# Altium schematic sheet mounting_circuit.SchDoc
size A4; SheetNumber: 2; SheetTotal: 5
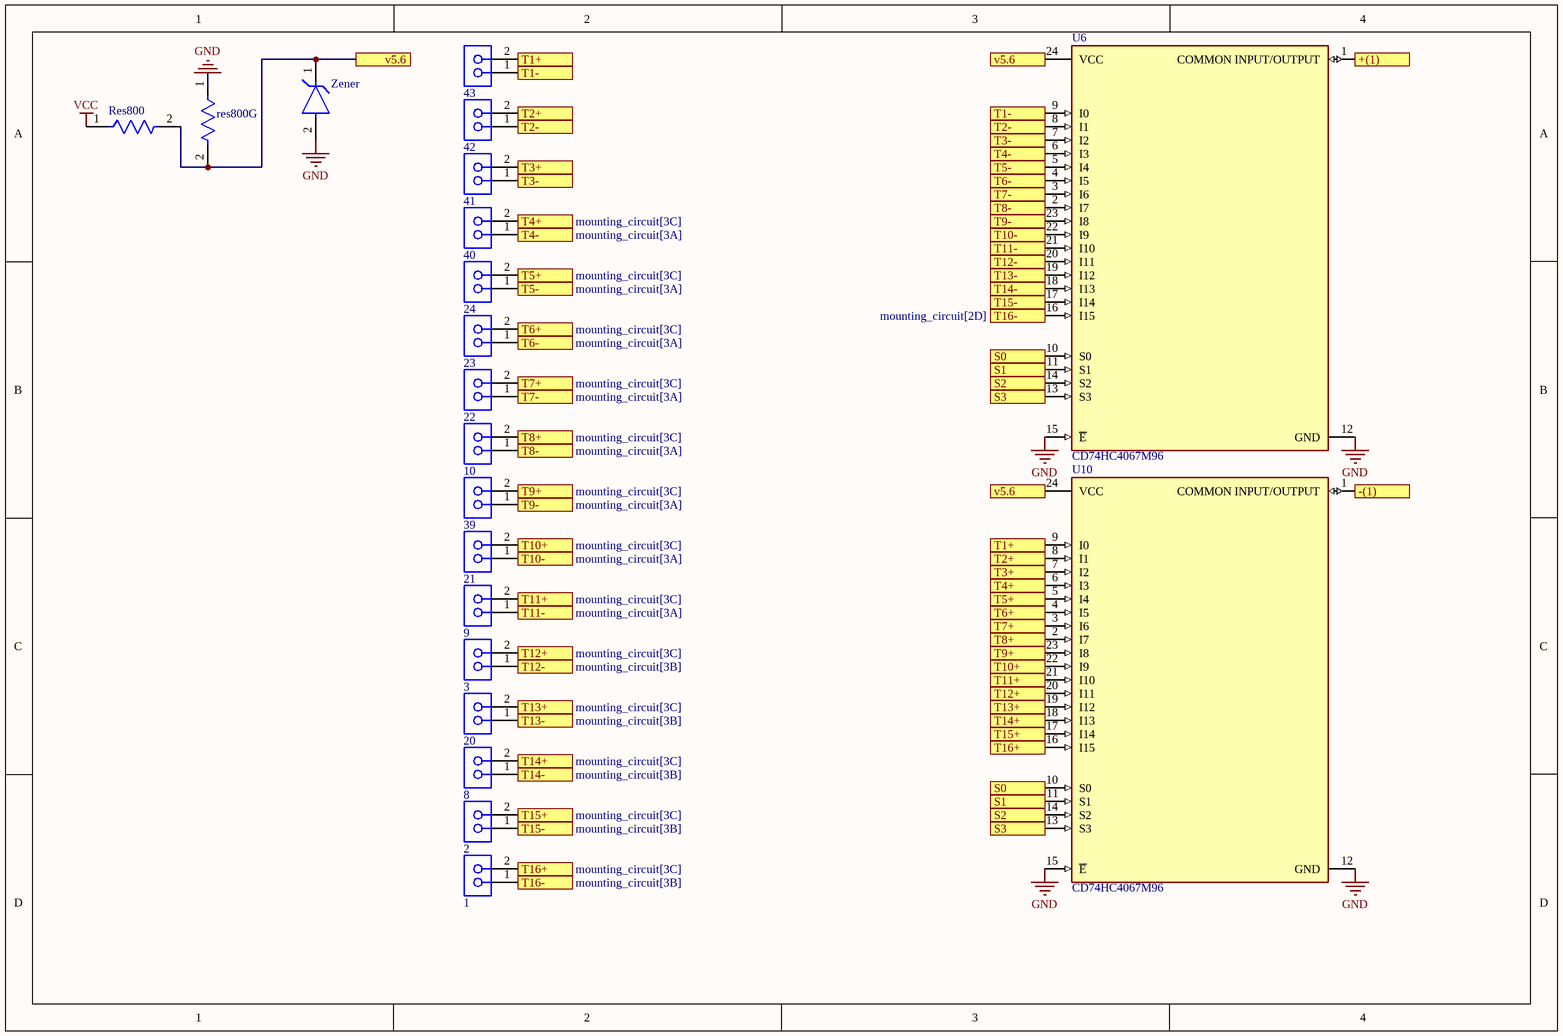
[diagram p0: mounting_circuit.SchDoc]

## Parts
1  Comment  [SMTC-SSW-102-02-X-S]  (value not drawn)
2  Comment  [SMTC-SSW-102-02-X-S]  (value not drawn)
3  Comment  [SMTC-SSW-102-02-X-S]  (value not drawn)
8  Comment  [SMTC-SSW-102-02-X-S]  (value not drawn)
9  1  [SMTC-SSW-102-02-X-S]  (value not drawn)
10  Comment  [SMTC-SSW-102-02-X-S]  (value not drawn)
20  Comment  [SMTC-SSW-102-02-X-S]  (value not drawn)
21  Comment  [SMTC-SSW-102-02-X-S]  (value not drawn)
22  Comment  [SMTC-SSW-102-02-X-S]  (value not drawn)
23  Comment  [SMTC-SSW-102-02-X-S]  (value not drawn)
24  0  [SMTC-SSW-102-02-X-S]  (value not drawn)
39  Comment  [SMTC-SSW-102-02-X-S]  (value not drawn)
40  0  [SMTC-SSW-102-02-X-S]  (value not drawn)
41  Comment  [SMTC-SSW-102-02-X-S]  (value not drawn)
42  Comment  [SMTC-SSW-102-02-X-S]  (value not drawn)
43  Comment  [SMTC-SSW-102-02-X-S]  (value not drawn)
Res800  MCA12060D8000BP500  [FP-MCA1206-IPC_C]  (value not drawn)
res800G  MCA12060D8000BP500  [FP-MCA1206-IPC_C]  (value not drawn)
U6  CD74HC4067M96  [FP-DW0024A-MFG]
U10  CD74HC4067M96  [FP-DW0024A-MFG]
Zener  MM3Z5V6ST1G  [FP-477-02-MFG]  (value not drawn)

## Ports
+(1), -(1), S0 (see mounting_circuit(2)[2B], mounting_circuit(2)[2D], mounting_circuit(3)[2B], mounting_circuit(3)[2D], mounting_circuit[3B]), S0 (see mounting_circuit(2)[2B], mounting_circuit(2)[2D], mounting_circuit(3)[2B], mounting_circuit(3)[2D], mounting_circuit[3D]), S1 (see mounting_circuit(2)[2B], mounting_circuit(2)[2D], mounting_circuit(3)[2B], mounting_circuit(3)[2D], mounting_circuit[3B]), S1 (see mounting_circuit(2)[2B], mounting_circuit(2)[2D], mounting_circuit(3)[2B], mounting_circuit(3)[2D], mounting_circuit[3D]), S2 (see mounting_circuit(2)[2B], mounting_circuit(2)[2D], mounting_circuit(3)[2B], mounting_circuit(3)[2D], mounting_circuit[3B]), S2 (see mounting_circuit(2)[2B], mounting_circuit(2)[2D], mounting_circuit(3)[2B], mounting_circuit(3)[2D], mounting_circuit[3D]), S3 (see mounting_circuit(2)[2B], mounting_circuit(2)[2D], mounting_circuit(3)[2B], mounting_circuit(3)[2D], mounting_circuit[3B]), S3 (see mounting_circuit(2)[2B], mounting_circuit(2)[2D], mounting_circuit(3)[2B], mounting_circuit(3)[2D], mounting_circuit[3D]), T1+ (see mounting_circuit[2A]), T1+ (see mounting_circuit[3C]), T1- (see mounting_circuit[2A]), T1- (see mounting_circuit[3A]), T2+ (see mounting_circuit[2A]), T2+ (see mounting_circuit[3C]), T2- (see mounting_circuit[2A]), T2- (see mounting_circuit[3A]), T3+ (see mounting_circuit[2A]), T3+ (see mounting_circuit[3C]), T3- (see mounting_circuit[2A]), T3- (see mounting_circuit[3A]), T4+ (see mounting_circuit[2A]), T4+ (see mounting_circuit[3C]), T4- (see mounting_circuit[2A]), T4- (see mounting_circuit[3A]), T5+ (see mounting_circuit[2B]), T5+ (see mounting_circuit[3C]), T5- (see mounting_circuit[2B]), T5- (see mounting_circuit[3A]), T6+ (see mounting_circuit[2B]), T6+ (see mounting_circuit[3C]), T6- (see mounting_circuit[2B]), T6- (see mounting_circuit[3A]), T7+ (see mounting_circuit[2B]), T7+ (see mounting_circuit[3C]), T7- (see mounting_circuit[2B]), T7- (see mounting_circuit[3A]), T8+ (see mounting_circuit[2B]), T8+ (see mounting_circuit[3C]), T8- (see mounting_circuit[2B]), T8- (see mounting_circuit[3A]), T9+ (see mounting_circuit[2B]), T9+ (see mounting_circuit[3C]), T9- (see mounting_circuit[2B]), T9- (see mounting_circuit[3A]), T10+ (see mounting_circuit[2C]), T10+ (see mounting_circuit[3C]), T10- (see mounting_circuit[2C]), T10- (see mounting_circuit[3A]), T11+ (see mounting_circuit[2C]), T11+ (see mounting_circuit[3C]), T11- (see mounting_circuit[2C]), T11- (see mounting_circuit[3A]), T12+ (see mounting_circuit[2C]), T12+ (see mounting_circuit[3C]), T12- (see mounting_circuit[2C]), T12- (see mounting_circuit[3B]), T13+ (see mounting_circuit[2C]), T13+ (see mounting_circuit[3C]), T13- (see mounting_circuit[2C]), T13- (see mounting_circuit[3B]), T14+ (see mounting_circuit[2C]), T14+ (see mounting_circuit[3C]), T14- (see mounting_circuit[2D]), T14- (see mounting_circuit[3B]), T15+ (see mounting_circuit[2D]), T15+ (see mounting_circuit[3C]), T15- (see mounting_circuit[2D]), T15- (see mounting_circuit[3B]), T16+ (see mounting_circuit[2D]), T16+ (see mounting_circuit[3C]), T16- (see mounting_circuit[2D]), T16- (see mounting_circuit[3B]), v5.6 (see mounting_circuit(2)[2A], mounting_circuit(2)[2C], mounting_circuit(3)[2A], mounting_circuit(3)[2C], mounting_circuit(4)[2A], mounting_circuit(4)[2C], mounting_circuit[1A], mounting_circuit[3A]), v5.6 (see mounting_circuit(2)[2A], mounting_circuit(2)[2C], mounting_circuit(3)[2A], mounting_circuit(3)[2C], mounting_circuit(4)[2A], mounting_circuit(4)[2C], mounting_circuit[1A], mounting_circuit[3B]), v5.6 (see mounting_circuit(2)[2A], mounting_circuit(2)[2C], mounting_circuit(3)[2A], mounting_circuit(3)[2C], mounting_circuit(4)[2A], mounting_circuit(4)[2C], mounting_circuit[3A], mounting_circuit[3B])

## Nets
GND: res800G.1 U6.12(GND) U6.15(~{E}) U10.12(GND) U10.15(~{E}) Zener.2(A)
VCC: Res800.1
+(1): U6.1(COMMON_INPUT/OUTPUT) ; port +(1)
-(1): U10.1(COMMON_INPUT/OUTPUT) ; port -(1)
S0: U6.10(S0) U10.10(S0) ; port S0
S1: U6.11(S1) U10.11(S1) ; port S1
S2: U6.14(S2) U10.14(S2) ; port S2
S3: U6.13(S3) U10.13(S3) ; port S3
T1+: 43.2 U10.9(I0) ; port T1+
T1-: 43.1 U6.9(I0) ; port T1-
T2+: 42.2 U10.8(I1) ; port T2+
T2-: 42.1 U6.8(I1) ; port T2-
T3+: 41.2 U10.7(I2) ; port T3+
T3-: 41.1 U6.7(I2) ; port T3-
T4+: 40.2 U10.6(I3) ; port T4+
T4-: 40.1 U6.6(I3) ; port T4-
T5+: 24.2 U10.5(I4) ; port T5+
T5-: 24.1 U6.5(I4) ; port T5-
T6+: 23.2 U10.4(I5) ; port T6+
T6-: 23.1 U6.4(I5) ; port T6-
T7+: 22.2 U10.3(I6) ; port T7+
T7-: 22.1 U6.3(I6) ; port T7-
T8+: 10.2 U10.2(I7) ; port T8+
T8-: 10.1 U6.2(I7) ; port T8-
T9+: 39.2 U10.23(I8) ; port T9+
T9-: 39.1 U6.23(I8) ; port T9-
T10+: 21.2 U10.22(I9) ; port T10+
T10-: 21.1 U6.22(I9) ; port T10-
T11+: 9.2 U10.21(I10) ; port T11+
T11-: 9.1 U6.21(I10) ; port T11-
T12+: 3.2 U10.20(I11) ; port T12+
T12-: 3.1 U6.20(I11) ; port T12-
T13+: 20.2 U10.19(I12) ; port T13+
T13-: 20.1 U6.19(I12) ; port T13-
T14+: 8.2 U10.18(I13) ; port T14+
T14-: 8.1 U6.18(I13) ; port T14-
T15+: 2.2 U10.17(I14) ; port T15+
T15-: 2.1 U6.17(I14) ; port T15-
T16+: 1.2 U10.16(I15) ; port T16+
T16-: 1.1 U6.16(I15) ; port T16-
v5.6: Res800.2 res800G.2 U6.24(VCC) U10.24(VCC) Zener.1(C) ; port v5.6

## Library data of the parts
1-3 8-10 20-24 39-43 = CMP-1023-00323-1: SQ Post Socket, Through-hole, Vertical, -55 to 105 degC, 2.54 mm Pitch, 2-Pin, Female, RoHS; Manufacturer: Samtec; PartNumber: SSW-102-02-T-S; Pitch: 2.54 mm; ComponentLink3Description: Package Specification; ComponentLink2Description: Datasheet; ComponentLink1Description: Manufacturer URL; PackageVersion: CA, 6/1987; DatasheetVersion: F-214; PackageDescription: Assembly, Socket Strip .016 X .031 Tail; ComponentLink2URL: http://www.samtec.com/documents/webfiles/pdf/SSW_TH.PDF; RoHS: True; ComponentLink3URL: http://www.samtec.com/documents/webfiles/cpdf/SSW-1XX-XX-XXX-X-XX-XXX-XX-MKT.pdf; ComponentLink1URL: http://www.samtec.com; PackageReference: SSW-102-02-X-S; Mounting Technology: Through-hole; Orientation: Vertical; Temperature Range: -55 to 105 degC
Res800 res800G = CMP-02407-008722-1: Res MC Precision Thin Film 1206 800Ω 0.1% 0.25W ±25ppm/°C Molded Paper T/R; Resistance: 800R; Max Power Dissipation: 250mW; Lead Free: Lead Free; Package Quantity: 5000; Composition: Thin Film; Tolerance: 0.1%; Number of Terminations: 2; Length: 0.126inch; Width: 0.063inch; Max Operating Temperature: 125°C; Packaging: Tape and Reel; Min Operating Temperature: -55°C; Case/Package: 1206; Temperature Coefficient: 25ppm/°C; Height: 0.026inch
U6 U10 = CMP-04901-000007-1: IC MUX/DEMUX 1X16 24SOIC; Manufacturer: Texas Instruments; Standoff Height: 0.1mm; Logic Function Desc: Non-Inverting; Max Supply Voltage: 6V; Number Of Inputs: 16; Quiescent Current: 8uA; Number Of Circuits: 1; Propagation Delay: 6ns; Max Junction Temp: +150°C; Min Supply Voltage: 2V; ComponentLink2Description: Datasheet; Octopart: https://octopart.com/cd74hc4067m96-texas+instruments-722802; Ambient Temperature Range High: +125°C; Ipc Land Pattern Name: SOIC127P1030X265-24; Height: 2.65mm; Mouser Description: Multiplexer Switch ICs Hi-Spd CMOS 16Ch Anl Mltplxr/Demltplxr; Temperature Range Low: -55°C; Package: DW0024A; Temperature Range High: +125°C; Lead Free: Yes; ComponentLink2URL: http://www.ti.com/lit/ds/symlink/cd74hc4067.pdf; Manufacturer Part Number: CD74HC4067M96; RoHS: TRUE; Automotive: No; Device Class L1: Integrated Circuits (ICs); Digikey Description: IC MUX/DEMUX 1X16 24SOIC; Device Class L2: Logic ICs; Temperature: -55°C to +125°C; Device Class L3: Multiplexers; Category: IC; Ambient Temperature Range Low: -55°C; Number Of Outputs: 1
Zener = CMP-1060-00706-2: DIODE ZENER 5.6V 300MW SOD323; Test Current: 5mA; Power Rating: 200mW; ESD Protection: Yes; Peak Reverse Current: 1uA; Voltage Tolerance: 2%; Forward Voltage: 900mV; Impedance: 40R; Element Configuration: Single; Zener Current: 10mA; Length: 1.8mm; Package Quantity: 1; Contact Plating: Tin; Number of Pins: 2; Case/Package: SOD-323-2; Max Power Dissipation: 200mW; Lead Free: Lead Free; Radiation Hardening: No; Width: 1.35mm; REACH SVHC: No SVHC; Zener Voltage: 5.6V; Height: 1mm; Max Reverse Leakage Current: 1uA; Packaging: Tape and Reel; Min Operating Temperature: -65°C; Voltage Rating (DC): 5.6V; Power Dissipation: 200mW; Max Operating Temperature: 150°C; Working Voltage: 5.6V; Material: Plastic; Tolerance: 2%